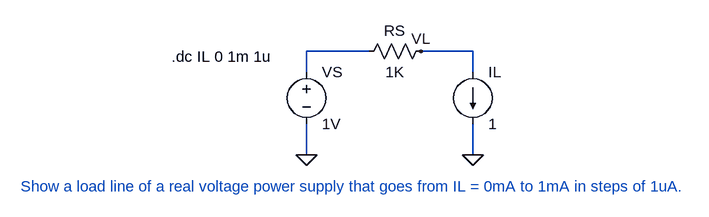
[diagram p0: schematic 01_realVoltageSource.asc]
01_realVoltageSource.asc, the LTspice schematic file:
Version 4
SHEET 1 880 680
WIRE 176 16 80 16
WIRE 336 16 256 16
WIRE 80 48 80 16
WIRE 336 48 336 16
WIRE 80 176 80 128
WIRE 336 176 336 128
FLAG 80 176 0
FLAG 256 16 VL
FLAG 336 176 0
SYMBOL res 272 0 R90
WINDOW 0 0 56 VBottom 2
WINDOW 3 32 56 VTop 2
SYMATTR InstName RS
SYMATTR Value 1K
SYMBOL voltage 80 32 R0
WINDOW 123 0 0 Left 0
WINDOW 39 0 0 Left 0
SYMATTR InstName VS
SYMATTR Value 1V
SYMBOL current 336 48 R0
SYMATTR InstName IL
SYMATTR Value 1
TEXT -128 24 Left 2 !.dc IL 0 1m 1u
TEXT -360 224 Left 2 ;Show a load line of a real voltage power supply that goes from IL = 0mA to 1mA in steps of 1uA.

The netlist it stands for:
* 01_realVoltageSource.asc
RS VL N001 1K
VS N001 0 1V
IL VL 0 1
.dc IL 0 1m 1u
* Show a load line of a real voltage power supply that goes from IL = 0mA to 1mA in steps of 1uA.
.backanno
.end